# Altium project GSHT_V1.4.PrjPCB
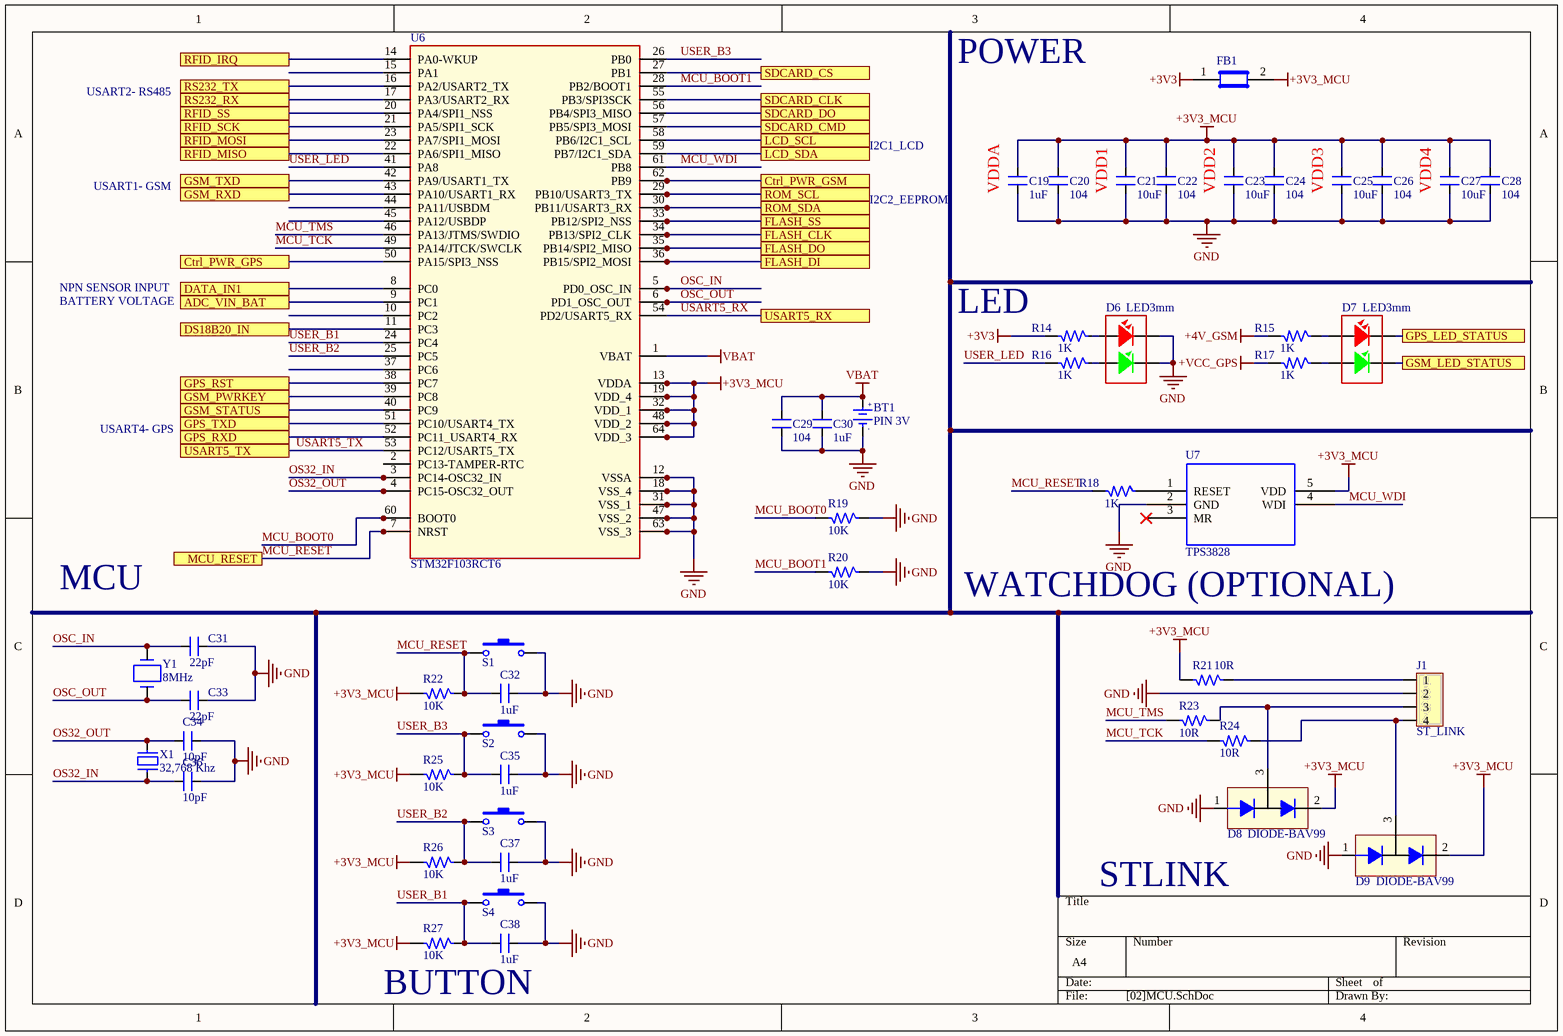
[diagram p0: [02]MCU.SchDoc]
3 sheets, 85 parts. Net scope: flat (ports and power ports of the same name join across sheets).
Board file: GSHT_V1.4_PCB.PcbDoc
Sheets:
  [02]MCU.SchDoc
  [05]RS232_USB.SchDoc
  [07]RFID_LCD.SchDoc

## Sheet [02]MCU.SchDoc
size A4

### Parts
BT1  PIN 3V  [CR1220 SMD]
C19  1uF  [C0603 SMT]
C20  104  [C0603 SMT]
C21  10uF  [C0603 SMT]
C22  104  [C0603 SMT]
C23  10uF  [C0603 SMT]
C24  104  [C0603 SMT]
C25  10uF  [C0603 SMT]
C26  104  [C0603 SMT]
C27  10uF  [C0603 SMT]
C28  104  [C0603 SMT]
C29  104  [C0603 SMT]
C30  1uF  [C0603 SMT]
C31  22pF  [C0603 SMT]
C32  1uF  [C0603 SMT]
C33  22pF  [C0603 SMT]
C34  10pF  [C0603 SMT]
C35  1uF  [C0603 SMT]
C36  10pF  [C0603 SMT]
C37  1uF  [C0603 SMT]
C38  1uF  [C0603 SMT]
D6  LED3mm  [LED 2 holder 3mm]
D7  LED3mm  [LED 2 holder 3mm]
D8  DIODE-BAV99  [SOT23]
D9  DIODE-BAV99  [SOT23]
FB1  BLM21PG600SN1D  [RES-SMD-0805]  (value not drawn)
J1  ST_LINK  [CON_4P]
R14  1K  [RES-SMD-0805]
R15  1K  [RES-SMD-0805]
R16  1K  [RES-SMD-0805]
R17  1K  [RES-SMD-0805]
R18  1K  [RES-SMD-0603]
R19  10K  [R0603 -SMT]
R20  10K  [R0603 -SMT]
R21  10R  [RES-SMD-0603]
R22  10K  [R0603 -SMT]
R23  10R  [RES-SMD-0603]
R24  10R  [RES-SMD-0603]
R25  10K  [R0603 -SMT]
R26  10K  [R0603 -SMT]
R27  10K  [R0603 -SMT]
S1  SW-SMD  [SW-SMD]  (value not drawn)
S2  SW-SMD  [BUTTON NGHIENG]  (value not drawn)
S3  SW-SMD  [BUTTON NGHIENG]  (value not drawn)
S4  SW-SMD  [BUTTON NGHIENG]  (value not drawn)
U6  STM32F103RCT6  [LQFP-64]
U7  TPS3828  [TPS3828]
X1  32,768 Khz  [XT32kn]
Y1  8MHz  [ABM7_v1_1_BIG]

### Ports
ADC_VIN_BAT, Ctrl_PWR_GPS, Ctrl_PWR_GSM, DATA_IN1, DS18B20_IN, FLASH_CLK, FLASH_DI, FLASH_DO, FLASH_SS, GPS_LED_STATUS, GPS_RST, GPS_RXD, GPS_TXD, GSM_LED_STATUS, GSM_PWRKEY, GSM_RXD, GSM_STATUS, GSM_TXD, LCD_SCL, LCD_SDA, MCU_RESET, RFID_IRQ, RFID_MISO, RFID_MOSI, RFID_SCK, RFID_SS, ROM_SCL, ROM_SDA, RS232_RX, RS232_TX, SDCARD_CLK, SDCARD_CMD, SDCARD_CS, SDCARD_DO, USART5_RX, USART5_TX

### Nets
+3V3: FB1.1 R14.2
+3V3_MCU: C19.2 C20.2 C21.2 C22.2 C23.2 C24.2 C25.2 C26.2 C27.2 C28.2 D8.2 D9.2 FB1.2 R21.2 R22.2 R25.2 R26.2 R27.2 U6.13(VDDA) U6.19(VDD_4) U6.32(VDD_1) U6.48(VDD_2) U6.64(VDD_3) U7.5(VDD)
+4V_GSM: R15.2
+VCC_GPS: R17.2
GND: BT1.2(GND) C19.1 C20.1 C21.1 C22.1 C23.1 C24.1 C25.1 C26.1 C27.1 C28.1 C29.1 C30.1 C31.2 C32.2 C33.2 C34.2 C35.2 C36.2 C37.2 C38.2 D6.1 D6.3 D8.1 D9.1 J1.2 R19.1 R20.1 S1.2 S2.2 S3.2 S4.2 U6.12(VSSA) U6.18(VSS_4) U6.31(VSS_1) U6.47(VSS_2) U6.63(VSS_3) U7.2(GND)
VBAT: BT1.1(+3V) C29.2 C30.2 U6.1(VBAT)
MCU_BOOT0: R19.2 U6.60(BOOT0)
MCU_BOOT1: R20.2 U6.28(PB2/BOOT1)
MCU_RESET: C32.1 R18.2 R22.1 S1.1 U6.7(NRST) ; port MCU_RESET
MCU_TCK: R24.2 U6.49(PA14/JTCK/SWCLK)
MCU_TMS: R23.2 U6.46(PA13/JTMS/SWDIO)
MCU_WDI: U6.61(PB8) U7.4(WDI)
OS32_IN: C36.1 U6.3(PC14-OSC32_IN) X1.1
OS32_OUT: C34.1 U6.4(PC15-OSC32_OUT) X1.2
OSC_IN: C31.1 U6.5(PD0_OSC_IN) Y1.2
OSC_OUT: C33.1 U6.6(PD1_OSC_OUT) Y1.1
USART5_RX: U6.54(PD2/USART5_RX) ; port USART5_RX
USART5_TX: U6.53(PC12/USART5_TX) ; port USART5_TX
USER_B1: C38.1 R27.1 S4.1 U6.24(PC4)
USER_B2: C37.1 R26.1 S3.1 U6.25(PC5)
USER_B3: C35.1 R25.1 S2.1 U6.26(PB0)
USER_LED: R16.2 U6.41(PA8)
NetD6_2: D6.2 R14.1
NetD6_4: D6.4 R16.1
NetD7_1: D7.1 ; port GPS_LED_STATUS
NetD7_2: D7.2 R15.1
NetD7_3: D7.3 ; port GSM_LED_STATUS
NetD7_4: D7.4 R17.1
NetD8_3: D8.3 J1.3 R23.1
NetD9_3: D9.3 J1.4 R24.1
NetJ1_1: J1.1 R21.1
NetLCD1_3: U6.58(PB6/I2C1_SCL) ; port LCD_SCL
NetLCD1_4: U6.59(PB7/I2C1_SDA) ; port LCD_SDA
NetR18_1: R18.1 U7.1(RESET)
NetR58_1: U6.17(PA3/USART2_RX) ; port RS232_RX
NetRFID1_1: U6.20(PA4/SPI1_NSS) ; port RFID_SS
NetRFID1_2: U6.21(PA5/SPI1_SCK) ; port RFID_SCK
NetRFID1_3: U6.23(PA7/SPI1_MOSI) ; port RFID_MOSI
NetRFID1_4: U6.22(PA6/SPI1_MISO) ; port RFID_MISO
NetRFID1_5: U6.14(PA0-WKUP) ; port RFID_IRQ
NetU6_8: U6.8(PC0) ; port DATA_IN1
NetU6_9: U6.9(PC1) ; port ADC_VIN_BAT
NetU6_11: U6.11(PC3) ; port DS18B20_IN
NetU6_16: U6.16(PA2/USART2_TX) ; port RS232_TX
NetU6_27: U6.27(PB1) ; port SDCARD_CS
NetU6_29: U6.29(PB10/USART3_TX) ; port ROM_SCL
NetU6_30: U6.30(PB11/USART3_RX) ; port ROM_SDA
NetU6_33: U6.33(PB12/SPI2_NSS) ; port FLASH_SS
NetU6_34: U6.34(PB13/SPI2_CLK) ; port FLASH_CLK
NetU6_35: U6.35(PB14/SPI2_MISO) ; port FLASH_DO
NetU6_36: U6.36(PB15/SPI2_MOSI) ; port FLASH_DI
NetU6_38: U6.38(PC7) ; port GPS_RST
NetU6_39: U6.39(PC8) ; port GSM_PWRKEY
NetU6_40: U6.40(PC9) ; port GSM_STATUS
NetU6_42: U6.42(PA9/USART1_TX) ; port GSM_TXD
NetU6_43: U6.43(PA10/USART1_RX) ; port GSM_RXD
NetU6_50: U6.50(PA15/SPI3_NSS) ; port Ctrl_PWR_GPS
NetU6_51: U6.51(PC10/USART4_TX) ; port GPS_TXD
NetU6_52: U6.52(PC11_USART4_RX) ; port GPS_RXD
NetU6_55: U6.55(PB3/SPI3SCK) ; port SDCARD_CLK
NetU6_56: U6.56(PB4/SPI3_MISO) ; port SDCARD_DO
NetU6_57: U6.57(PB5/SPI3_MOSI) ; port SDCARD_CMD
NetU6_62: U6.62(PB9) ; port Ctrl_PWR_GSM

Not connected (* = marked no-connect by the designer): U6 2(PC13-TAMPER-RTC) 10(PC2) 15(PA1) 37(PC6) 44(PA11/USBDM) 45(PA12/USBDP); U7 3(MR)*

### Notes on the sheet
- USART2- RS485
- POWER
- I2C1_LCD
- USART1- GSM
- I2C2_EEPROM
- (near C19) VDDA
- (near C21) VDD1
- (near C23) VDD2
- (near C25) VDD3
- (near C27) VDD4
- NPN SENSOR INPUT
- BATTERY VOLTAGE
- LED
- USART4- GPS
- MCU
- WATCHDOG (OPTIONAL)
- (near D8) STLINK
- BUTTON
- (in symbol PIN 3V) +; -

### Library data of the parts
BT1 = PIN 3V: Battery 3VDC; Value: PIN 3V
C19-C38 = CM: Cap SMD; Value: 103
D6 D7 = LED2Holder_3mm: LED 2 holder RGB 3mm; Value: LED 3 ly Single Colour
D8 D9 = DIODE-BAV99: ZENER, SOT23,; Manufacturer: ON Semiconductor / Fairchild; Manufacturer Part Number: BAV99; .Creator: LeKhaLinh; Other Drawings: Diode Circuit; PCN Design/Specification: Mold Compound 12/Dec/2007; PCN Assembly/Origin: SOT23 Manufacturing Source 31/May2013 / Assembly Site Addition 20/Jul/2015; PCN Packaging: Binary Year Code Marking 15/Jan/2014; Diode Configuration: 1 Pair Series Connection; Diode Type: Standard; Voltage - DC Reverse (Vr) (Max): 70V; Current - Average Rectified (Io) (per Diode): 200mA; Voltage - Forward (Vf) (Max) @ If: 1.25V @ 150mA; Speed: Small Signal =; Reverse Recovery Time (trr): 6ns; Current - Reverse Leakage @ Vr: 2.5µA @ 70V; Online Catalog: Diode Array; Other Names: BAV99FSDKR; .CheckPCB: LeKhaLinh; .CheckSCH: LeKhaLinh; Supplier 1: Digi-Key; Stock 1: 1165; Pricing 1: 1=0.26, 10=0.21, 100=0.1115, 500=0.0734, 1000=0.0499 (USD); Standard Package: 1; Category: Discrete Semiconductor Products; Family: Diodes, Rectifiers - Arrays; Packaging: Digi-Reel®; Mounting Type: Surface Mount; Package / Case: TO-236-3, SC-59, SOT-23-3; Supplier Device Package: SOT-23-3 (TO-236); ComponentLink1URL: https://www.fairchildsemi.com/package-drawings/MA/MA03B.pdf?src-supplier=Digi-Key; ComponentLink1Description: https://www.fairchildsemi.com/package-drawings/MA/MA03B.pdf?src-supplier=Digi-Key; ComponentLink2URL: http://www.farnell.com/datasheets/1822674.pdf?src-supplier=Element14; ComponentLink2Description: http://www.farnell.com/datasheets/1822674.pdf?src-supplier=Element14; ComponentLink3URL: http://www.mouser.com/ds/2/149/BAV99-22788.pdf?src-supplier=Mouser; ComponentLink3Description: http://www.mouser.com/ds/2/149/BAV99-22788.pdf?src-supplier=Mouser; ComponentLink4URL: http://www.fairchildsemi.com/ds/BA/BAV99.pdf?src-supplier=Avnet+Europe; ComponentLink4Description: http://www.fairchildsemi.com/ds/BA/BAV99.pdf?src-supplier=Avnet+Europe; ComponentLink5URL: https://www.verical.com/server-webapp/html/getDatasheet?partID=110217&src-supplier=Verical; ComponentLink5Description: https://www.verical.com/server-webapp/html/getDatasheet?partID=110217&src-supplier=Verical; ComponentLink6URL: http://www.farnell.com/datasheets/2304409.pdf?src-supplier=Element14; ComponentLink6Description: http://www.farnell.com/datasheets/2304409.pdf?src-supplier=Element14; Supplier 2: Mouser; Stock 2: 0; Supplier 3: Arrow; Stock 3: 5700; Pricing 3: 1=0.1933, 10=0.1873, 25=0.1555, 100=0.0806, 250=0.0724, 500=0.0523, 1000=0.0428, 3000=0.0342 (USD); Supplier Part Number 1: BAV99FSCT-ND; Supplier Part Number 2: 512-BAV99; Supplier Part Number 3: BAV99
FB1 = Ferrite Bead
J1 = Header4: Header IDC, 4 x 1 Pin Vertical 2.54mm Pitch (Non-Boxed, Male); Manufacturer: W¨¹rth Elektronik eiSos GmbH; partNo: 613002143121; ComponentLink1 Description: Manufacturer; ComponentLink2 Description: Datasheet; NoPins: 02; Created Date: 29 March 2013; ComponentLink1URL: http://www.we-online.com; ComponentLink2URL: http://katalog.we-online.de/em/datasheet/6130xx143121.pdf; Created by: Karrer Zheng
R14-R18 = RM: Resistor SMD; Value: 1K
R19-R27 = RM: Resistor SMD; Value: 1K
S1-S4 = SW-SMD: Switch; Published: 24-Mar-1999; LatestRevisionDate: 17-Jul-2002; LatestRevisionNote: Re-released for DXP Platform.; PackageReference: SPST-2; Publisher: Altium Limited
U6 = STM32F103RCT6: MCU 32BIT 256KB FLASH 64LQFP
X1 = XT32k: Crystal 32,768kHz for timer real; Value: 32,768khz
Y1 = ABM7-16.000MHZ-D2Y-T: CRYSTAL 16MHZ 18PF SMD; Manufacturer: Abracon LLC; Frequency Stability: ±30ppm; Frequency Tolerance: ±20ppm; ESR (Equivalent Series Resistance): 50 Ohm; Operating Mode: Fundamental; .Creator: MM; .Checked PCB: RF; Supplier 1: Digi-Key; Manufacturer Part Number: ABM7-16.000MHZ-D2Y-T; RoHS: RoHS Compliant; Category: Crystals and Oscillators; Stock 1: 5861; Pricing 1: 1=0.96, 10=0.847, 50=0.791, 100=0.7, 500=0.6615 (USD); Packaging: Cut Tape (CT); Type: MHz Crystal; Frequency: 16MHz; Load Capacitance: 18pF; Operating Temperature: -40°C ~ 85°C; Ratings: -; Mounting Type: Surface Mount; Package / Case: 2-SMD; Size / Dimension: 0.236" L x 0.138" W (6.00mm x 3.50mm); Height: 0.055" (1.40mm); ComponentLink1URL: http://www.abracon.com/Resonators/abm7.pdf; ComponentLink1Description: http://www.abracon.com/Resonators/abm7.pdf; Supplier Part Number 1: 535-9840-1-ND; .Checked SCH: RF

## Sheet [05]RS232_USB.SchDoc
size A4
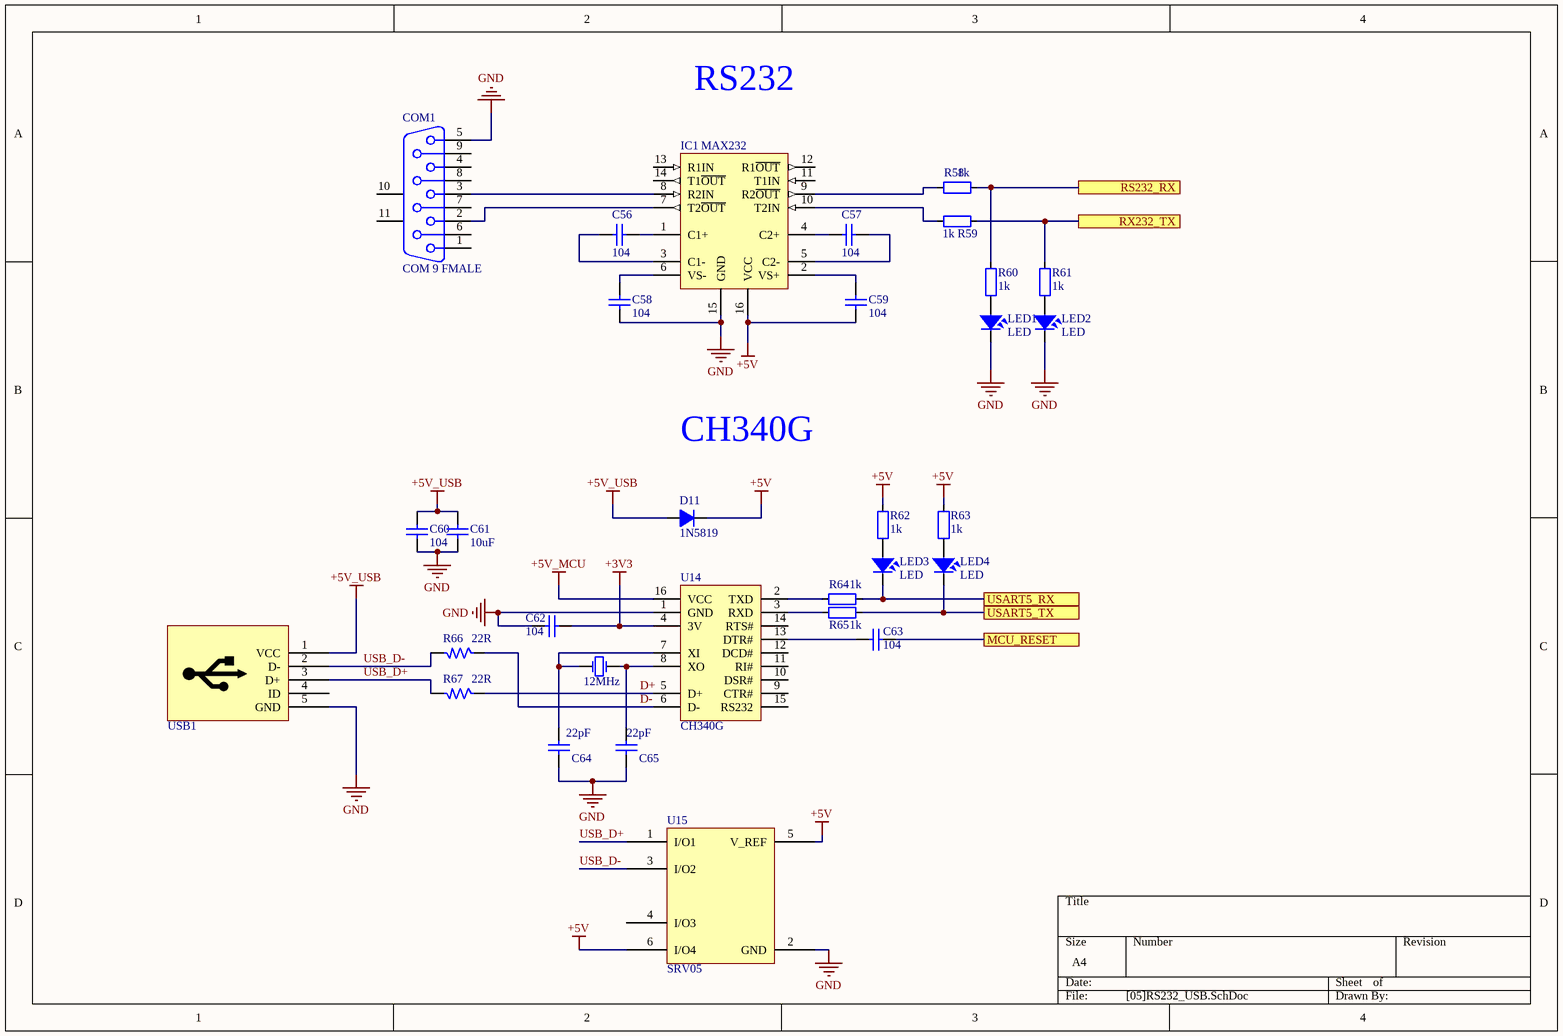
[diagram p1: [05]RS232_USB.SchDoc]

### Parts
C56  104  [CAP_0603]
C57  104  [CAP_0603]
C58  104  [CAP_0603]
C59  104  [CAP_0603]
C60  104  [CAP_0603]
C61  10uF  [CAP_0603]
C62  104  [CAP_0603]
C63  104  [CAP_0603]
C64  22pF  [CAP_0603]
C65  22pF  [CAP_0603]
COM1  COM 9 FMALE  [DSB 9-F]
D11  1N5819  [DO-214AB SMA]
IC1  MAX232  [MAX232DR]
LED1  LED  [LED-0805-Green]
LED2  LED  [LED-0805-Green]
LED3  LED  [LED-0805-Green]
LED4  LED  [LED-0805-Green]
R58  1k  [RES-SMD-0603]
R59  1k  [RES-SMD-0603]
R60  1k  [RES-SMD-0603]
R61  1k  [RES-SMD-0603]
R62  1k  [RES-SMD-0603]
R63  1k  [RES-SMD-0603]
R64  1k  [RES-SMD-0603]
R65  1k  [RES-SMD-0603]
R66  22R  [RES-SMD-0603]
R67  22R  [RES-SMD-0603]
U14  CH340G  [SO16]
U15  SRV05  [SOT23-6]
USB1  USB  [USB-B-Mini]  (value not drawn)
Y2  12MHz  [XTAL-5032]

### Ports
MCU_RESET, RS232_RX, RX232_TX, USART5_RX, USART5_TX

### Nets
+3V3: C62.2 U14.4(3V)
+5V: C59.2 D11.2(K) IC1.16(VCC) R62.2 R63.2 U15.5(V_REF) U15.6(I/O4)
+5V_MCU: U14.16(VCC)
+5V_USB: C60.2 C61.2 D11.1(A) USB1.1(VCC)
GND: C58.2 C60.1 C61.1 C62.1 C64.2 C65.2 COM1.5 IC1.15(GND) LED1.2 LED2.2 U14.1(GND) U15.2(GND) USB1.5(GND)
D+: R67.1 U14.5(D+)
D-: R66.1 U14.6(D-)
MCU_RESET: C63.2 ; port MCU_RESET
USART5_RX: LED3.2 R64.2 ; port USART5_RX
USART5_TX: LED4.2 R65.2 ; port USART5_TX
USB_D+: R67.2 U15.1(I/O1) USB1.3(D+)
USB_D-: R66.2 U15.3(I/O2) USB1.2(D-)
NetC56_1: C56.1 IC1.1(C1+)
NetC56_2: C56.2 IC1.3(C1-)
NetC57_1: C57.1 IC1.5(C2-)
NetC57_2: C57.2 IC1.4(C2+)
NetC58_1: C58.1 IC1.6(VS-)
NetC59_1: C59.1 IC1.2(VS+)
NetC63_1: C63.1 U14.13(DTR#)
NetC64_1: C64.1 U14.7(XI) Y2.1(OSC1)
NetC65_1: C65.1 U14.8(XO) Y2.2(OSC2)
NetCOM1_2: COM1.2 IC1.7(T2~{OUT})
NetCOM1_3: COM1.3 IC1.8(R2IN)
NetIC1_9: IC1.9(R2~{OUT}) R58.2
NetIC1_10: IC1.10(T2IN) R59.2
NetLED1_1: LED1.1 R60.1
NetLED2_1: LED2.1 R61.1
NetLED3_1: LED3.1 R62.1
NetLED4_1: LED4.1 R63.1
NetR58_1: R58.1 R60.2 ; port RS232_RX
NetR59_1: R59.1 R61.2 ; port RX232_TX
NetR64_1: R64.1 U14.2(TXD)
NetR65_1: R65.1 U14.3(RXD)

Not connected (* = marked no-connect by the designer): COM1 1 4 6 7 8 9 10(MH1) 11(MH2); IC1 11(T1IN) 12(R1~{OUT}) 13(R1IN) 14(T1~{OUT}); U14 9(CTR#) 10(DSR#) 11(RI#) 12(DCD#) 14(RTS#) 15(RS232); U15 4(I/O3); USB1 4(ID)

### Notes on the sheet
- RS232
- CH340G

### Library data of the parts
C56-C65 = CapSMD: Capacitor; Value: 33p; Published: 8-Jun-2000; LatestRevisionDate: 17-Jul-2002; LatestRevisionNote: Re-released for DXP Platform.; PackageReference: RAD-0.3; Publisher: Altium Limited
COM1 = DSB9F: COM 9; PackageDocument: O; Positions: 9; Gender: Receptacle; Value: COM 9; Published: 15-Jun-2001; LatestRevisionDate: 17-Jul-2002; LatestRevisionNote: Re-released for DXP Platform.; DatasheetDocument: 1-Sep-1999; PackageReference: 788750; Publisher: Altium Limited; Orientation: Right Angle
D11 = D1A_1: Diode 1A; Value: 1N4007
IC1 = MAX232: Dual EIA-232 Driver/Receiver; Value: MAX232
LED1-LED4 = LED: LED Single colour Green and Red; Value: LED 3 ly Single Colour
R58-R65 = Resistor - SMD: Resistor; Manufacturer: Generic Components; Class: Passive; Published: 08/06/2000; Publisher: Altium Hobart Technology Centre
R66 R67 = RM: Resistor SMD; Value: 1K
U14 = CH340G: High and Low Side Driver; Note: Pins 4, 8 and 14 are not connected; Published: 8-Jun-2000; LatestRevisionDate: 04-Mar-2005; LatestRevisionNote: Stylized 3D Model Added.; DatasheetVersion: PD60147J; PackageReference: PDIP14; Publisher: Altium Limited; PackageDescription: DIP; 14 Leads; Row Spacing 7.62 mm; Pitch 2.54 mm; ComponentLink1Description: Manufacturer Link; ComponentLink1URL: http://www.irf.com/; ComponentLink2Description: Datasheet; ComponentLink2URL: http://www.irf.com/product-info/datasheets/data/ir2110.pdf
U15 = SRV05: TVS DIODE 5V
USB1 = USB-M
Y2 = XTAL: Crystal Oscillator; Published: 8-Jun-2000; LatestRevisionDate: 17-Jul-2002; LatestRevisionNote: Re-released for DXP Platform.; PackageReference: R38; Publisher: Altium Limited

## Sheet [07]RFID_LCD.SchDoc
size A4
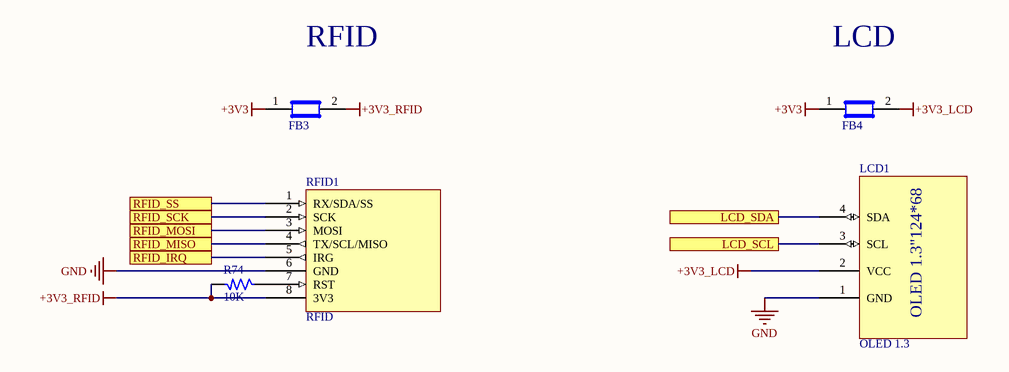
[diagram p2: [07]RFID_LCD.SchDoc]

### Parts
FB3  BLM21PG600SN1D  [R0805]  (value not drawn)
FB4  BLM21PG600SN1D  [R0805]  (value not drawn)
LCD1  OLED 1.3  [CON_4P]
R74  10K  [RES-SMD-0805]
RFID1  RFID  [RFID RC522]

### Ports
LCD_SCL, LCD_SDA, RFID_IRQ, RFID_MISO, RFID_MOSI, RFID_SCK, RFID_SS

### Nets
+3V3: FB3.1 FB4.1
+3V3_LCD: FB4.2 LCD1.2(VCC)
+3V3_RFID: FB3.2 R74.2 RFID1.8(3V3)
GND: LCD1.1(GND) RFID1.6(GND)
NetLCD1_3: LCD1.3(SCL) ; port LCD_SCL
NetLCD1_4: LCD1.4(SDA) ; port LCD_SDA
NetR74_1: R74.1 RFID1.7(RST)
NetRFID1_1: RFID1.1(RX/SDA/SS) ; port RFID_SS
NetRFID1_2: RFID1.2(SCK) ; port RFID_SCK
NetRFID1_3: RFID1.3(MOSI) ; port RFID_MOSI
NetRFID1_4: RFID1.4(TX/SCL/MISO) ; port RFID_MISO
NetRFID1_5: RFID1.5(IRG) ; port RFID_IRQ

### Notes on the sheet
- RFID
- LCD
- (in symbol OLED 1.3) OLED 1.3"124*68

### Library data of the parts
FB3 FB4 = Ferrite Bead
LCD1 = OLED 1.3: pin to pad: 1>4 2>3 3>2 4>1
R74 = RM: Resistor SMD; Value: 1K
RFID1 = RFID RC522

## Nets that join several sheets
+3V3: [02]MCU (FB1.1 R14.2), [05]RS232_USB (C62.2 U14.4), [07]RFID_LCD (FB3.1 FB4.1)
GND: [02]MCU (38 pins), [05]RS232_USB (13 pins), [07]RFID_LCD (LCD1.1 RFID1.6)
MCU_RESET: [02]MCU (5 pins), [05]RS232_USB (C63.2)
NetLCD1_3: [02]MCU (U6.58), [07]RFID_LCD (LCD1.3)
NetLCD1_4: [02]MCU (U6.59), [07]RFID_LCD (LCD1.4)
NetR58_1: [02]MCU (U6.17), [05]RS232_USB (R58.1 R60.2)
NetRFID1_1: [02]MCU (U6.20), [07]RFID_LCD (RFID1.1)
NetRFID1_2: [02]MCU (U6.21), [07]RFID_LCD (RFID1.2)
NetRFID1_3: [02]MCU (U6.23), [07]RFID_LCD (RFID1.3)
NetRFID1_4: [02]MCU (U6.22), [07]RFID_LCD (RFID1.4)
NetRFID1_5: [02]MCU (U6.14), [07]RFID_LCD (RFID1.5)
USART5_RX: [02]MCU (U6.54), [05]RS232_USB (LED3.2 R64.2)
USART5_TX: [02]MCU (U6.53), [05]RS232_USB (LED4.2 R65.2)